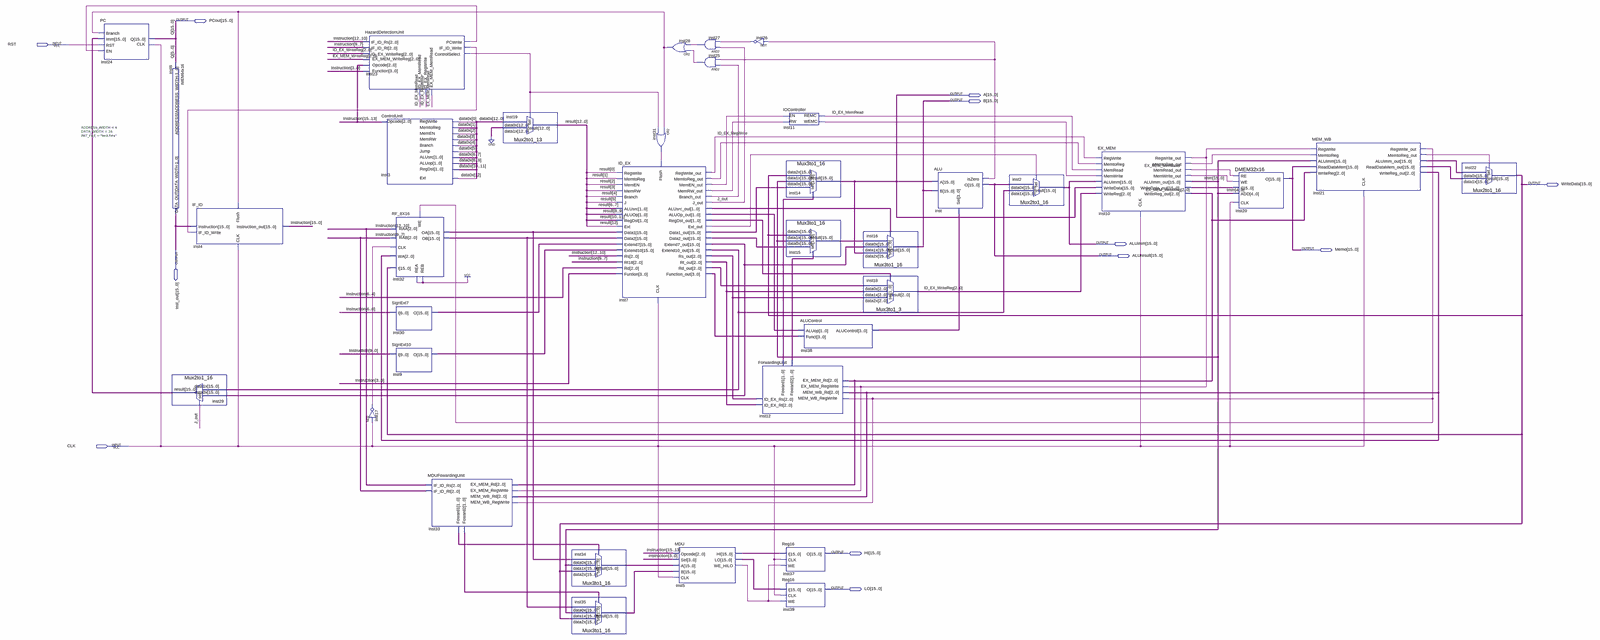
[diagram p0: schematic sheet, whole]
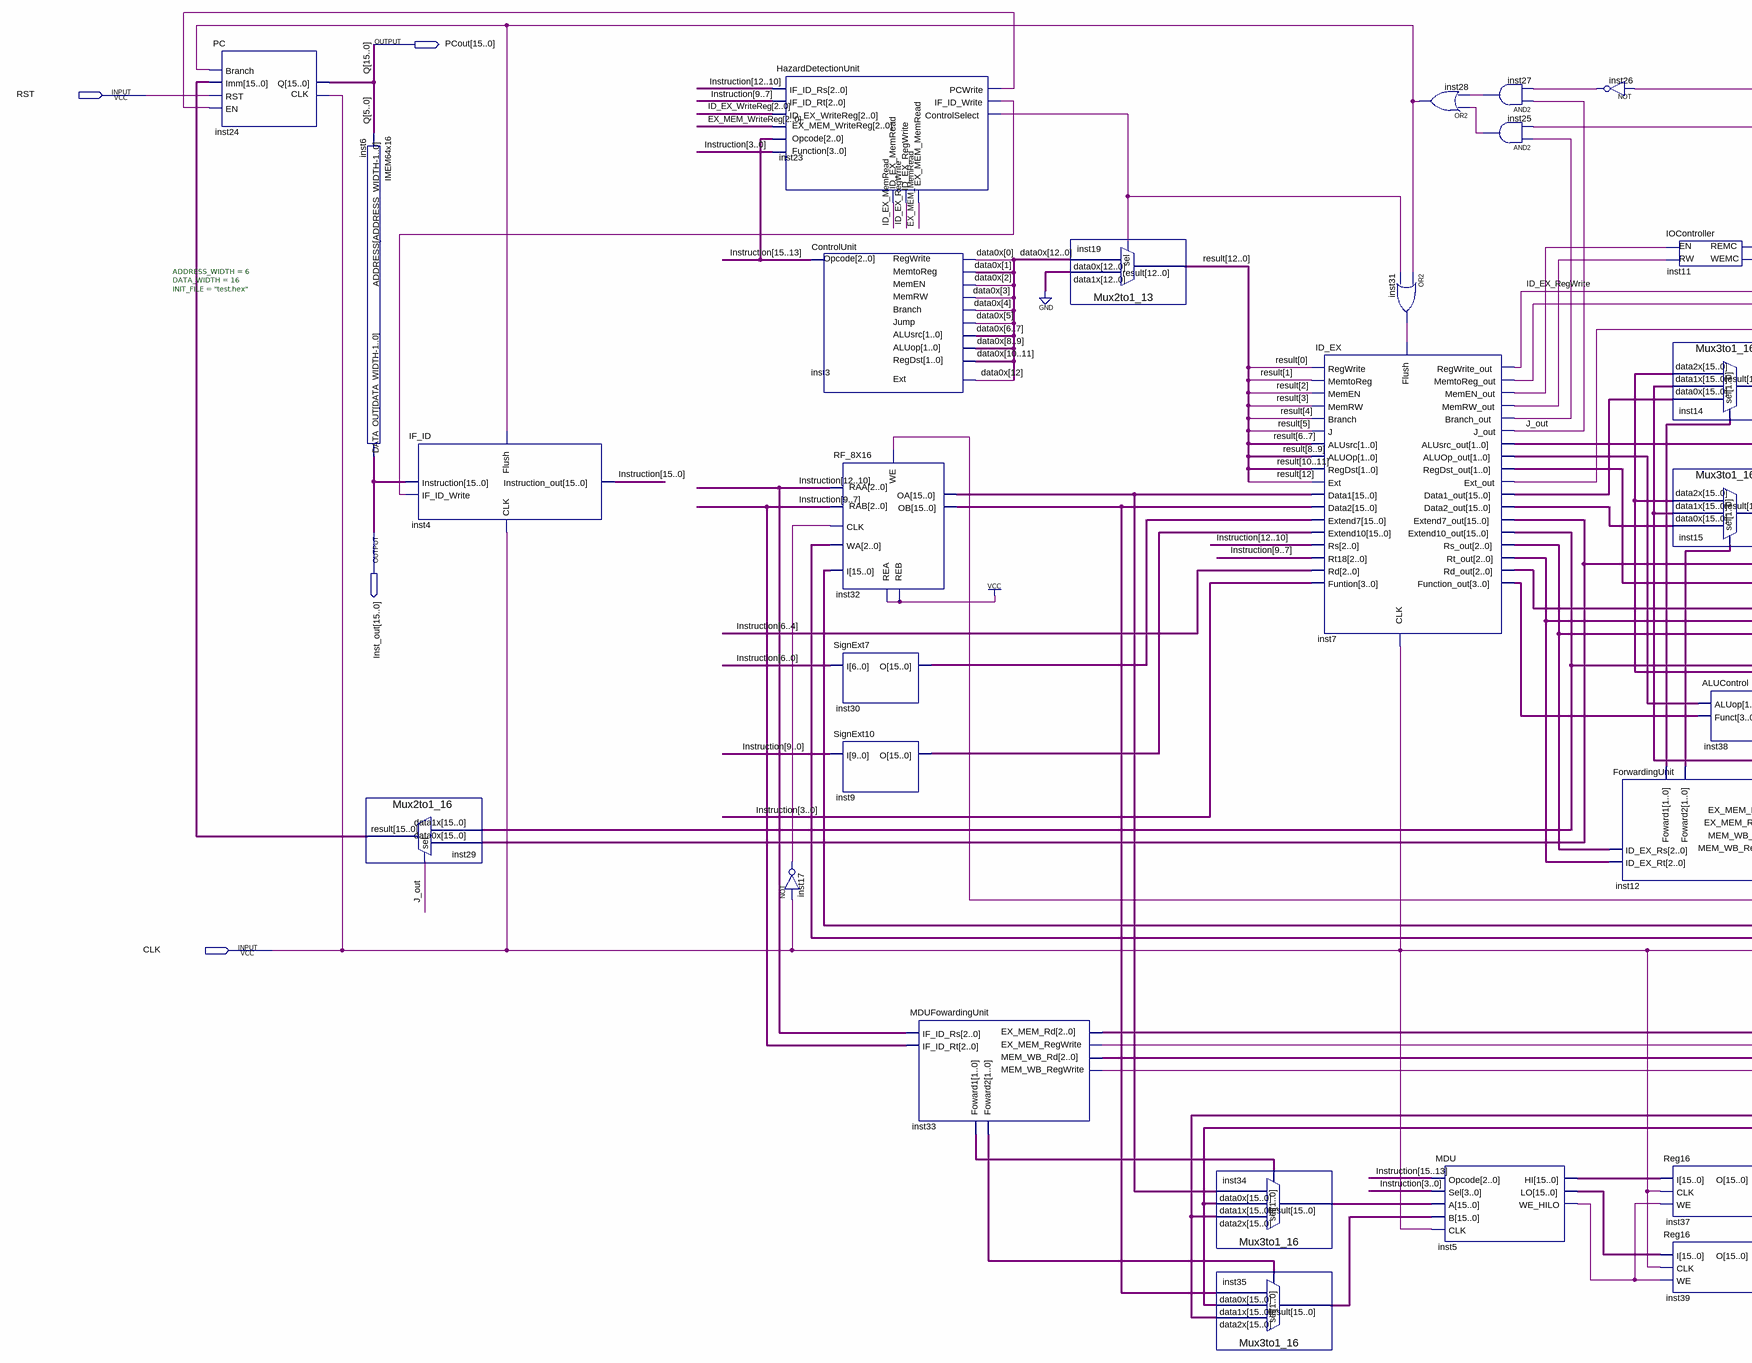
[diagram p1: schematic sheet, left part]
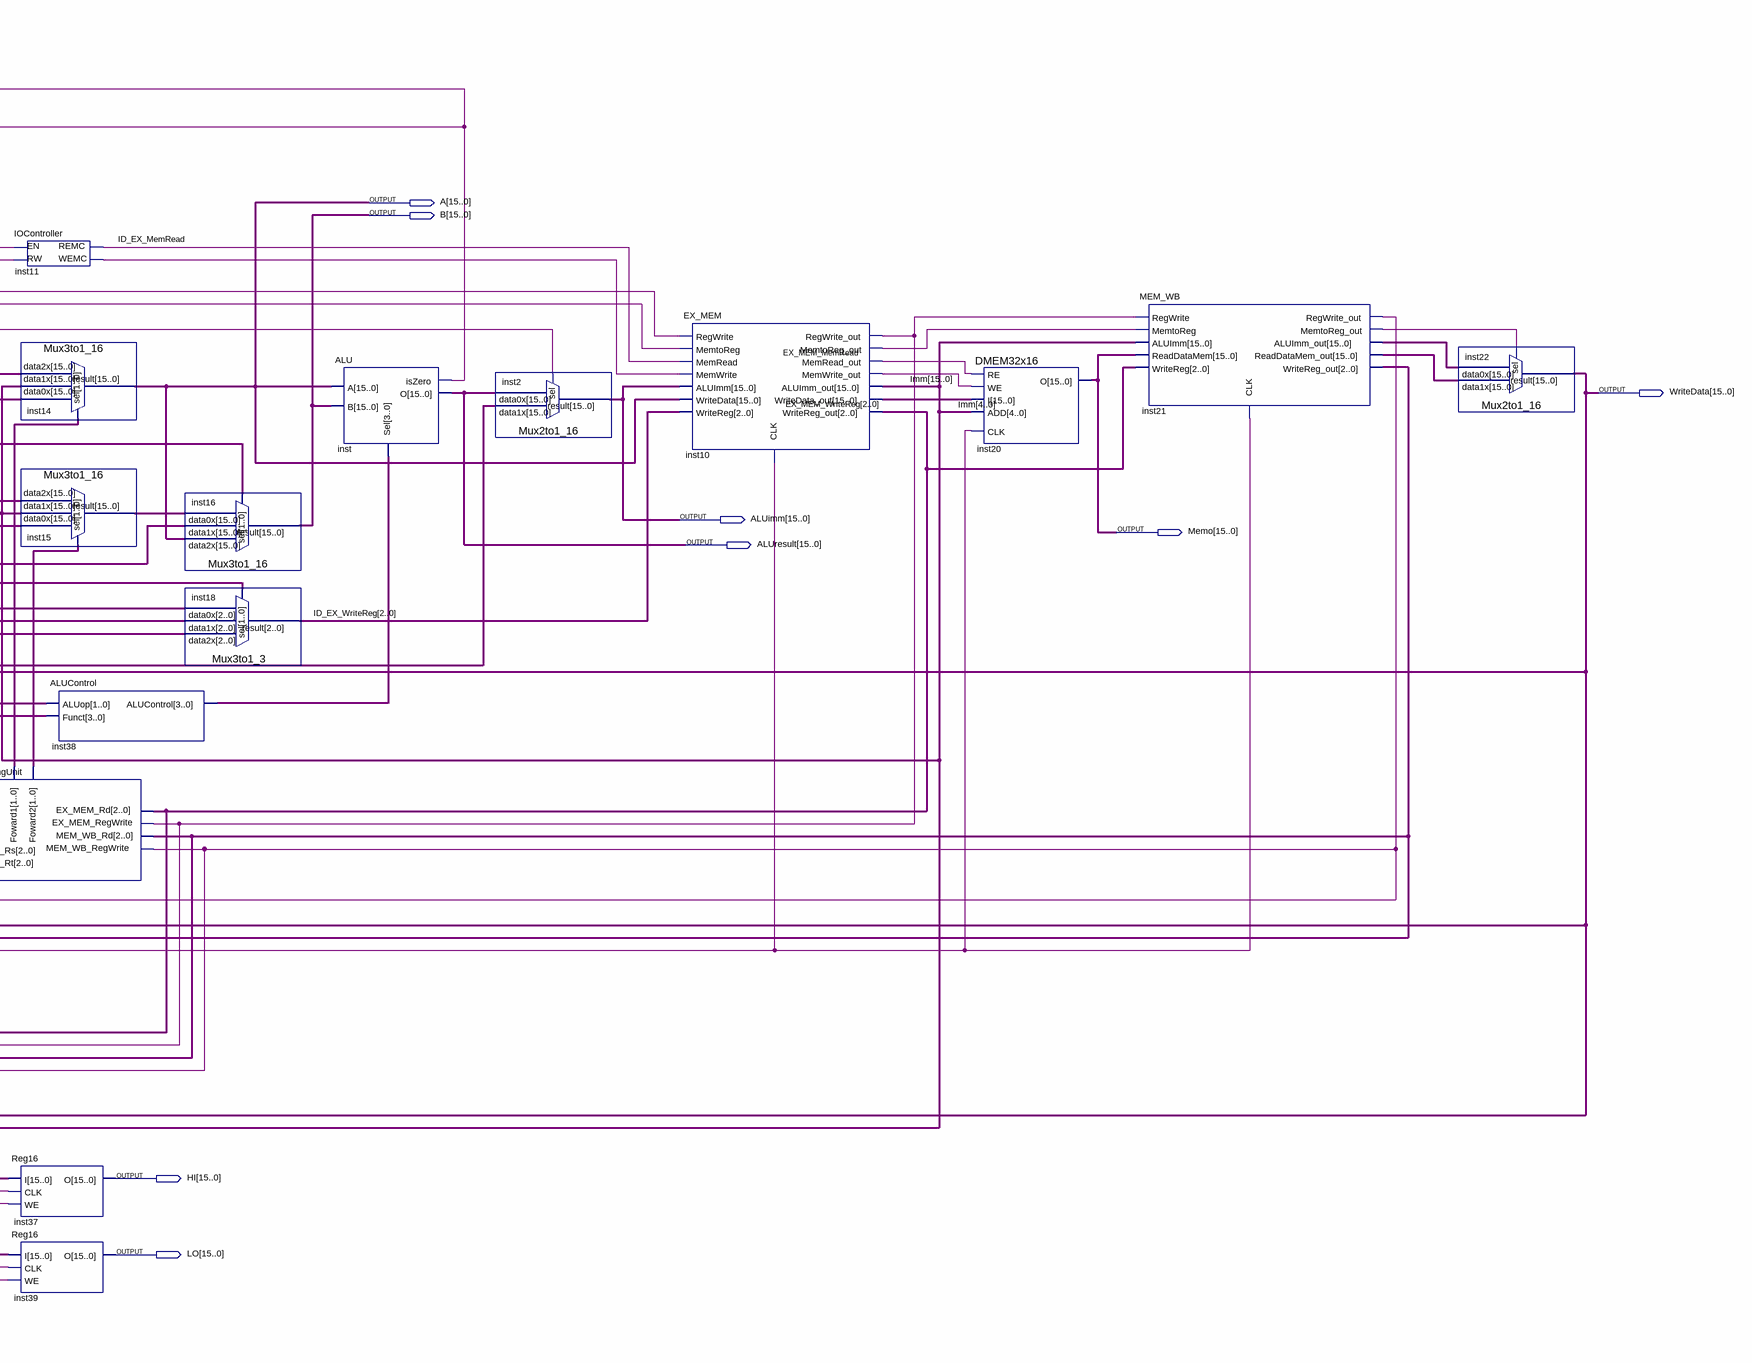
[diagram p2: schematic sheet, right part]
// Quartus schematic Pipeline.bdf as structural Verilog: 36 symbols, 12 pins
module Pipeline (
  input  RST,
  input  CLK,
  output [15:0] PCout,
  output [15:0] A,
  output [15:0] B,
  output [15:0] WriteData,
  output [15:0] ALUimm,
  output [15:0] Inst_out,
  output [15:0] Memo,
  output [15:0] ALUresult,
  output [15:0] HI,
  output [15:0] LO
);

  wire EX_MEM_MemRead, ID_EX_MemRead, ID_EX_RegWrite, inst5_we_hilo, inst7_branch_out, inst7_ext_out,
       inst7_memen_out, inst7_memrw_out, inst7_memtoreg_out, inst10_memtoreg_out, inst10_memwrite_out,
       inst10_regwrite_out, inst11_wemc, inst17_out, inst21_memtoreg_out, inst21_regwrite_out,
       inst23_controlselect, inst23_if_id_write, inst23_pcwrite, inst25_out, inst26_out, inst27_out,
       inst28_out, inst31_out, inst_iszero, J_out;
  wire [1:0] inst7_aluop_out, inst7_alusrc_out, inst7_regdst_out, inst12_foward1, inst12_foward2,
       inst33_foward1, inst33_foward2;
  wire [2:0] EX_MEM_WriteReg, ID_EX_WriteReg, inst7_rd_out, inst7_rs_out, inst7_rt_out, inst21_writereg_out;
  wire [3:0] inst7_function_out, inst38_alucontrol;
  wire [12:0] data0x, result;
  wire [15:0] Imm, inst5_hi, inst5_lo, inst7_data1_out, inst7_data2_out, inst7_extend7_out,
       inst7_extend10_out, inst9_o, inst10_writedata_out, inst15_result, inst21_aluimm_out,
       inst21_readdatamem_out, inst29_result, inst30_o, inst32_oa, inst32_ob, inst34_result, inst35_result,
       Instruction;

  PC inst24 (.CLK(CLK), .RST(RST), .EN(inst23_pcwrite), .Branch(inst28_out), .Imm(inst29_result), .Q(PCout));
  IMEM64x16 #(.ADDRESS_WIDTH(6), .DATA_WIDTH(16), .INIT_FILE("test.hex")) inst6 (
    .ADDRESS(PCout[5:0]), .DATA_OUT(Inst_out));
  Mux2to1_16 inst29 (.data1x(inst7_extend10_out), .data0x(inst7_extend7_out), .sel(J_out), .result(inst29_result));
  IF_ID inst4 (
    .Instruction(Inst_out), .IF_ID_Write(inst23_if_id_write), .CLK(CLK), .Flush(inst28_out),
    .Instruction_out(Instruction));
  HazardDetectionUnit inst23 (
    .IF_ID_Rs(Instruction[12:10]), .IF_ID_Rt(Instruction[9:7]), .Opcode(Instruction[15:13]),
    .ID_EX_MemRead(ID_EX_MemRead), .EX_MEM_MemRead(EX_MEM_MemRead), .ID_EX_RegWrite(ID_EX_RegWrite),
    .Function(Instruction[3:0]), .ID_EX_WriteReg(ID_EX_WriteReg), .EX_MEM_WriteReg(EX_MEM_WriteReg),
    .PCWrite(inst23_pcwrite), .IF_ID_Write(inst23_if_id_write), .ControlSelect(inst23_controlselect));
  not inst17 (inst17_out, CLK);
  ControlUnit inst3 (
    .Opcode(Instruction[15:13]), .RegDst({data0x[10], data0x[11]}), .ALUsrc({data0x[6], data0x[7]}),
    .RegWrite(data0x[0]), .Branch(data0x[4]), .Jump(data0x[5]), .ALUop({data0x[8], data0x[9]}),
    .Ext(data0x[12]), .MemEN(data0x[2]), .MemRW(data0x[3]), .MemtoReg(data0x[1]));
  RF_8X16 inst32 (
    .I(WriteData), .WA(inst21_writereg_out), .WE(inst21_regwrite_out), .RAA(Instruction[12:10]), .REA(1'b1),
    .RAB(Instruction[9:7]), .REB(1'b1), .CLK(inst17_out), .OB(inst32_ob), .OA(inst32_oa));
  SignExt7 inst30 (.I(Instruction[6:0]), .O(inst30_o));
  SignExt10 inst9 (.I(Instruction[9:0]), .O(inst9_o));
  MDUFowardingUnit inst33 (
    .IF_ID_Rs(Instruction[12:10]), .IF_ID_Rt(Instruction[9:7]), .EX_MEM_Rd(EX_MEM_WriteReg),
    .EX_MEM_RegWrite(inst10_regwrite_out), .MEM_WB_Rd(inst21_writereg_out),
    .MEM_WB_RegWrite(inst21_regwrite_out), .Foward1(inst33_foward1), .Foward2(inst33_foward2));
  Mux2to1_13 inst19 (.data1x({13{1'b0}}), .data0x(data0x), .sel(inst23_controlselect), .result(result));
  Mux3to1_16 inst34 (
    .data2x(WriteData), .data1x(Imm), .data0x(inst32_oa), .sel(inst33_foward1), .result(inst34_result));
  Mux3to1_16 inst35 (
    .data2x(WriteData), .data1x(Imm), .data0x(inst32_ob), .sel(inst33_foward2), .result(inst35_result));
  ID_EX inst7 (
    .RegWrite(result[0]), .MemEN(result[2]), .MemRW(result[3]), .Branch(result[4]), .J(result[5]),
    .ALUsrc({result[6], result[7]}), .ALUOp({result[8], result[9]}), .RegDst({result[10], result[11]}),
    .Ext(result[12]), .Data1(inst32_oa), .Data2(inst32_ob), .Extend7(inst30_o), .Extend10(inst9_o),
    .Rs(Instruction[12:10]), .Rt18(Instruction[9:7]), .Rd(Instruction[6:4]), .Funtion(Instruction[3:0]),
    .CLK(CLK), .Flush(inst31_out), .MemtoReg(result[1]), .RegWrite_out(ID_EX_RegWrite),
    .MemEN_out(inst7_memen_out), .MemRW_out(inst7_memrw_out), .Branch_out(inst7_branch_out), .J_out(J_out),
    .ALUsrc_out(inst7_alusrc_out), .ALUOp_out(inst7_aluop_out), .RegDst_out(inst7_regdst_out),
    .Ext_out(inst7_ext_out), .Data1_out(inst7_data1_out), .Data2_out(inst7_data2_out),
    .Extend7_out(inst7_extend7_out), .Extend10_out(inst7_extend10_out), .Rs_out(inst7_rs_out),
    .Rt_out(inst7_rt_out), .Rd_out(inst7_rd_out), .Function_out(inst7_function_out),
    .MemtoReg_out(inst7_memtoreg_out));
  or inst31 (inst31_out, inst28_out, inst23_controlselect);
  or inst28 (inst28_out, inst25_out, inst27_out);
  MDU inst5 (
    .Opcode(Instruction[15:13]), .Sel(Instruction[3:0]), .A(inst34_result), .B(inst35_result), .CLK(CLK),
    .HI(inst5_hi), .LO(inst5_lo), .WE_HILO(inst5_we_hilo));
  and inst27 (inst27_out, J_out, inst26_out);
  and inst25 (inst25_out, inst7_branch_out, inst_iszero);
  not inst26 (inst26_out, inst_iszero);
  ForwardingUnit inst12 (
    .ID_EX_Rs(inst7_rs_out), .ID_EX_Rt(inst7_rt_out), .EX_MEM_Rd(EX_MEM_WriteReg),
    .EX_MEM_RegWrite(inst10_regwrite_out), .MEM_WB_Rd(inst21_writereg_out),
    .MEM_WB_RegWrite(inst21_regwrite_out), .Foward1(inst12_foward1), .Foward2(inst12_foward2));
  IOController inst11 (.EN(inst7_memen_out), .RW(inst7_memrw_out), .REMC(ID_EX_MemRead), .WEMC(inst11_wemc));
  Mux3to1_16 inst14 (.data2x(WriteData), .data1x(Imm), .data0x(inst7_data1_out), .sel(inst12_foward1), .result(A));
  Mux3to1_16 inst15 (
    .data2x(WriteData), .data1x(Imm), .data0x(inst7_data2_out), .sel(inst12_foward2), .result(inst15_result));
  ALUControl inst38 (.ALUop(inst7_aluop_out), .Funct(inst7_function_out), .ALUControl(inst38_alucontrol));
  Reg16 inst37 (.I(inst5_hi), .CLK(CLK), .WE(inst5_we_hilo), .O(HI));
  Reg16 inst39 (.I(inst5_lo), .CLK(CLK), .WE(inst5_we_hilo), .O(LO));
  Mux3to1_16 inst16 (
    .data2x(A), .data1x(inst7_extend7_out), .data0x(inst15_result), .sel(inst7_alusrc_out), .result(B));
  Mux3to1_3 inst18 (
    .data2x(inst7_rs_out), .data1x(inst7_rt_out), .data0x(inst7_rd_out), .sel(inst7_regdst_out),
    .result(ID_EX_WriteReg));
  ALU inst (.Sel(inst38_alucontrol), .A(A), .B(B), .O(ALUresult), .isZero(inst_iszero));
  Mux2to1_16 inst2 (.data1x(inst7_extend10_out), .data0x(ALUresult), .sel(inst7_ext_out), .result(ALUimm));
  EX_MEM inst10 (
    .RegWrite(ID_EX_RegWrite), .MemtoReg(inst7_memtoreg_out), .MemRead(ID_EX_MemRead),
    .MemWrite(inst11_wemc), .ALUImm(ALUimm), .WriteData(A), .WriteReg(ID_EX_WriteReg), .CLK(CLK),
    .RegWrite_out(inst10_regwrite_out), .MemtoReg_out(inst10_memtoreg_out), .MemRead_out(EX_MEM_MemRead),
    .MemWrite_out(inst10_memwrite_out), .ALUImm_out(Imm), .WriteData_out(inst10_writedata_out),
    .WriteReg_out(EX_MEM_WriteReg));
  DMEM32x16 inst20 (
    .ADD(Imm[4:0]), .I(inst10_writedata_out), .WE(inst10_memwrite_out), .RE(EX_MEM_MemRead), .CLK(CLK),
    .O(Memo));
  MEM_WB inst21 (
    .RegWrite(inst10_regwrite_out), .MemtoReg(inst10_memtoreg_out), .ReadDataMem(Memo),
    .WriteReg(EX_MEM_WriteReg), .CLK(CLK), .ALUImm(Imm), .RegWrite_out(inst21_regwrite_out),
    .MemtoReg_out(inst21_memtoreg_out), .ReadDataMem_out(inst21_readdatamem_out),
    .WriteReg_out(inst21_writereg_out), .ALUImm_out(inst21_aluimm_out));
  Mux2to1_16 inst22 (
    .data1x(inst21_readdatamem_out), .data0x(inst21_aluimm_out), .sel(inst21_memtoreg_out), .result(WriteData));

  // Other names for the same wires on the sheet: Q[15:0] = PCout
endmodule
